# EAGLE design emonTx V4.0.1 (EAGLE 9.6.2)
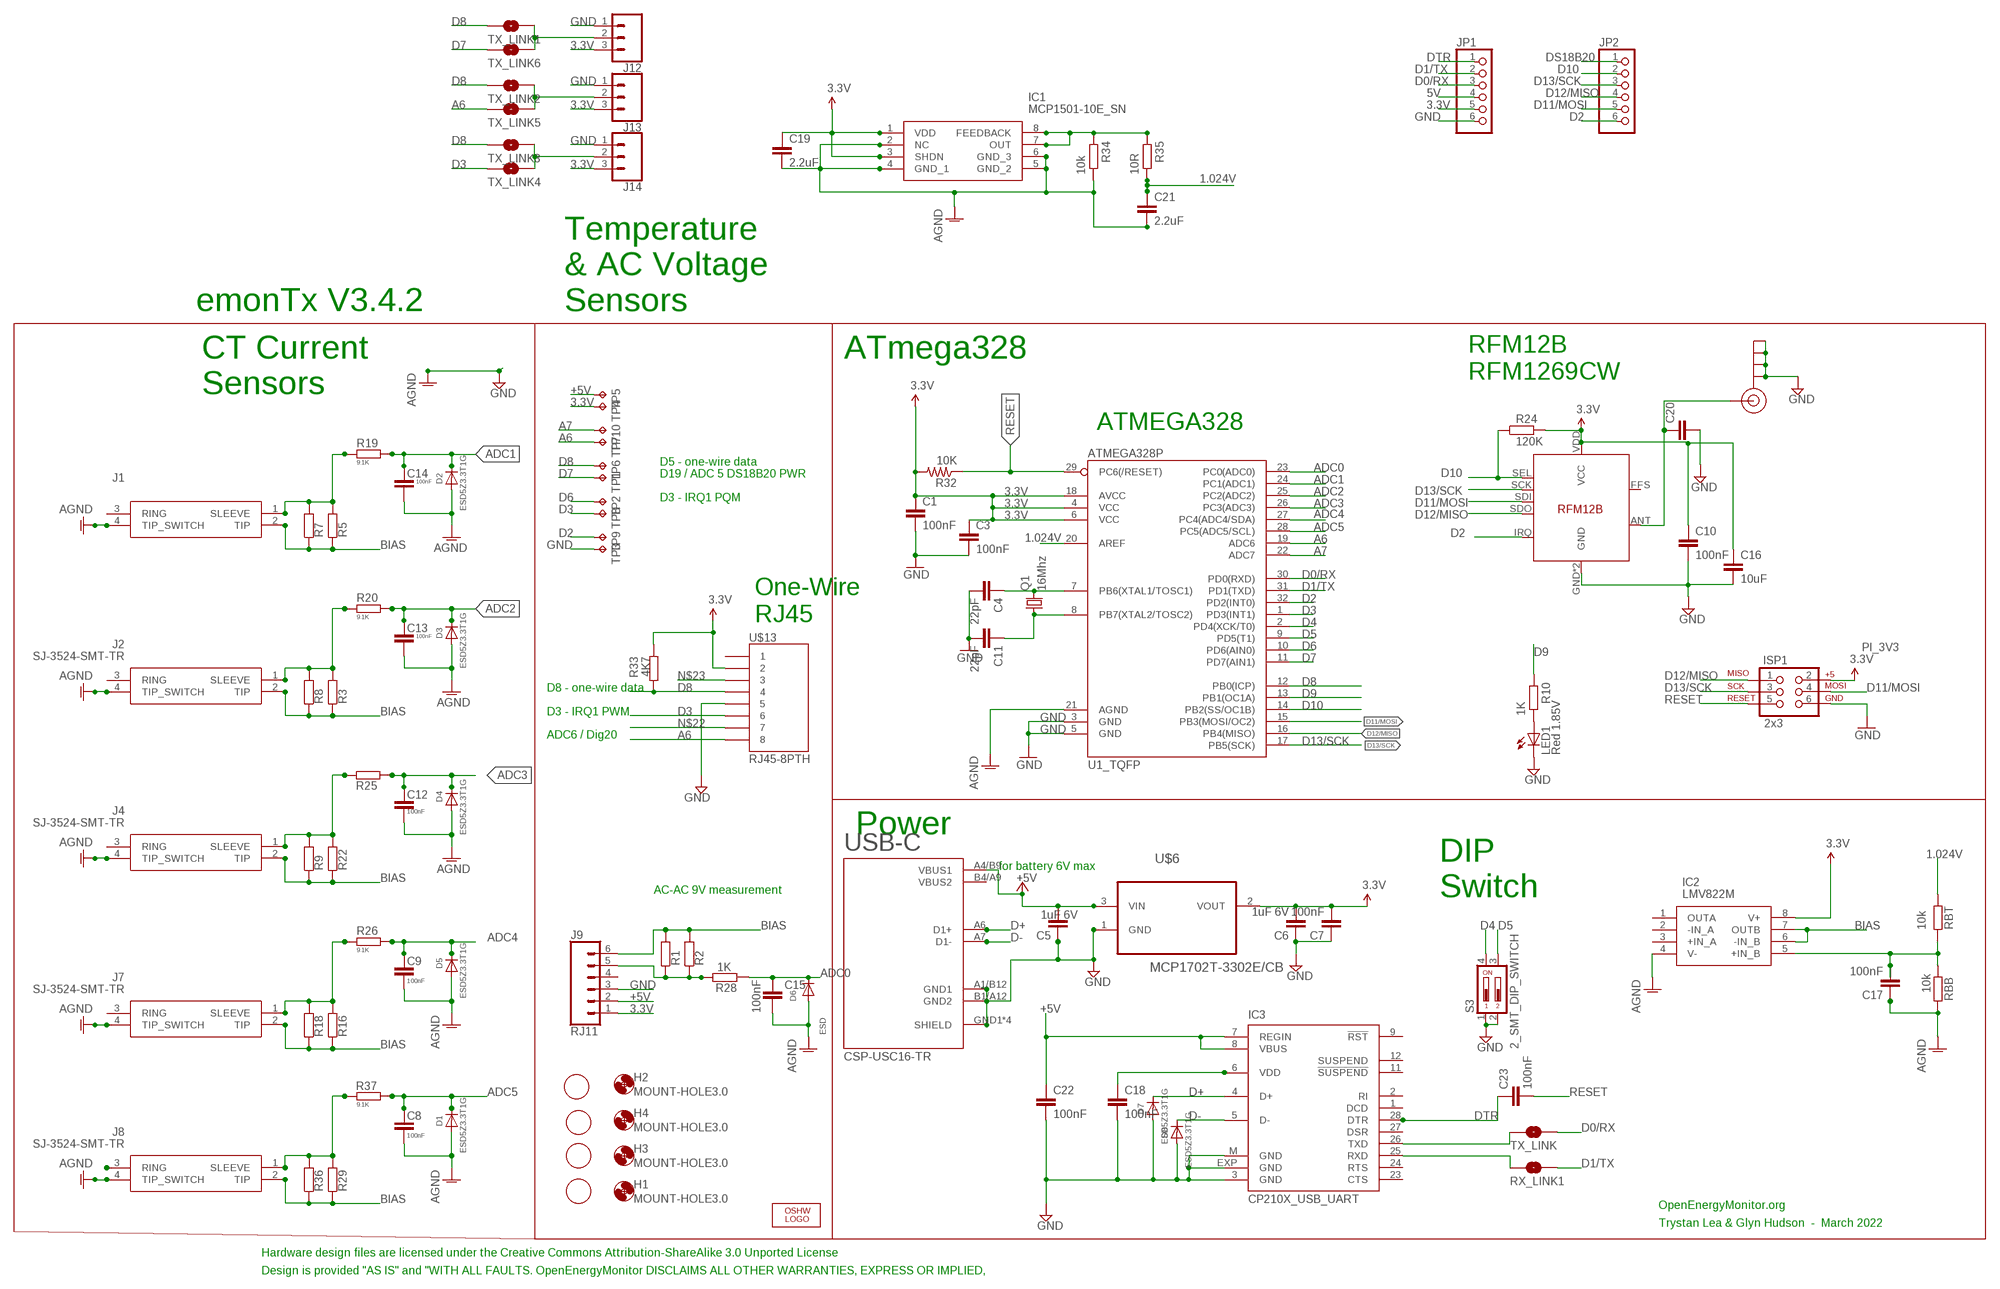
[diagram p0: schematic, sheet 1]

## Parts
C1  100nF  C-EUC0603  [C0603]
C3  100nF  C-EUC0603  [C0603]
C4  22pF  C-EUC0603  [C0603]
C5  1uF 6V  C-EUC0603  [C0603]
C6  1uF 6V  C-EUC0603  [C0603]
C7  100nF  C-EUC0603  [C0603]
C8  100nF  C-EUC0603  [C0603]
C9  100nF  C-EUC0603  [C0603]
C10  100nF  C-EUC0603  [C0603]
C11  22pF  C-EUC0603  [C0603]
C12  100nF  C-EUC0603  [C0603]
C13  100nF  C-EUC0603  [C0603]
C14  100nF  C-EUC0603  [C0603]
C15  100nF  C-EUC0603  [C0603]
C16  10uF  C-EUC0603  [C0603]
C17  100nF  C-EUC0603  [C0603]
C18  100nF  CAP0603-CAP  [0603-CAP]
C19  2.2uF  C-EUC0603  [C0603]
C20  ant tune?  C-EUC0603  [C0603]
C21  2.2uF  C-EUC0603  [C0603]
C22  100nF  CAP0603-CAP  [0603-CAP]
C23  100nF  C-EUC0603  [C0603]
D1  ESD5Z3.3T1G  DIODESOD-523  [SOD-523]
D2  ESD5Z3.3T1G  DIODESOD-523  [SOD-523]
D3  ESD5Z3.3T1G  DIODESOD-523  [SOD-523]
D4  ESD5Z3.3T1G  DIODESOD-523  [SOD-523]
D5  ESD5Z3.3T1G  DIODESOD-523  [SOD-523]
D6  ESD  DIODESOD-523  [SOD-523]
D7  ESD5Z3.3T1G  DIODESOD-523  [SOD-523]
D8  ESD5Z3.3T1G  DIODESOD-523  [SOD-523]
H1  MOUNT-HOLE3.0  [3,0]
H2  MOUNT-HOLE3.0  [3,0]
H3  MOUNT-HOLE3.0  [3,0]
H4  MOUNT-HOLE3.0  [3,0]
IC1  MCP1501-10E_SN  [SOIC127P600X175-8N]
IC2  LMV822M  [SOIC127P600X175-8N]
IC3  CP210X_USB_UART  [MLP28]
ISP1  2x3  AVR_SPI_PRG_6PTH  [2X3]
J1  SJ-3524-SMT-TR  [SJ-3524-SMT-TR]
J2  SJ-3524-SMT-TR  [SJ-3524-SMT-TR]
J4  SJ-3524-SMT-TR  [SJ-3524-SMT-TR]
J7  SJ-3524-SMT-TR  [SJ-3524-SMT-TR]
J8  SJ-3524-SMT-TR  [SJ-3524-SMT-TR]
J9  RJ11  RJ11-6  [RJ11-6]
J12  CONN_03SCREW  [SCREWTERMINAL-3.5MM-3]
J13  CONN_03SCREW  [SCREWTERMINAL-3.5MM-3]
J14  CONN_03SCREW  [SCREWTERMINAL-3.5MM-3]
J$1  SMA_EDGE  [SMA-EDGE]
JP1  PINHD-1X6  [1X06]
JP2  PINHD-1X6  [1X06]
LED1  Red 1.85V  LEDCHIP-LED0805  [CHIP-LED0805]
LOGO1  OSHW_LOGO_6MILX0200-NT  [OSHW_6X200_NOTEXT]
Q1  16Mhz  CRYSTALHC49UP  [HC49UP]
R1  R-EU_0204/7  [0204/7]
R2  R-EU_R1206  [R1206]
R3  R-EU_0204/7  [0204/7]
R5  R-EU_0204/7  [0204/7]
R7  R-EU_R1206  [R1206]
R8  R-EU_R1206  [R1206]
R9  R-EU_R1206  [R1206]
R10  1K  R-EU_R0603  [R0603]
R16  R-EU_0204/7  [0204/7]
R18  R-EU_R1206  [R1206]
R19  9.1K  R-EU_R0603  [R0603]
R20  9.1K  R-EU_R0603  [R0603]
R22  R-EU_0204/7  [0204/7]
R24  120K  R-EU_R0603  [R0603]
R25  9.1K  R-EU_R0603  [R0603]
R26  9.1K  R-EU_R0603  [R0603]
R28  1K  R-EU_R0603  [R0603]
R29  R-EU_0204/7  [0204/7]
R32  10K  R-US_R0603  [R0603]
R33  4K7  R-EU_R0603  [R0603]
R34  10k  R-EU_R0603  [R0603]
R35  10R  R-EU_R0603  [R0603]
R36  R-EU_R1206  [R1206]
R37  9.1K  R-EU_R0603  [R0603]
RBB  10k  R-EU_R0603  [R0603]
RBT  10k  R-EU_R0603  [R0603]
RX_LINK1  SOLDERJUMPERNC  [SJ_2S]
S3  2_SMT_DIP_SWITCH  [DIP_SWITCH_SMT]
TP1  TPPAD1-13  [P1-13]
TP2  TPPAD1-13  [P1-13]
TP3  TPPAD1-13  [P1-13]
TP4  TPPAD1-13  [P1-13]
TP5  TPPAD1-13  [P1-13]
TP6  TPPAD1-13  [P1-13]
TP7  TPPAD1-13  [P1-13]
TP8  TPPAD1-13  [P1-13]
TP9  TPPAD1-13  [P1-13]
TP10  TPPAD1-13  [P1-13]
TX_LINK  SOLDERJUMPERNC  [SJ_2S]
TX_LINK1  SOLDERJUMPERNC  [SJ_2S]
TX_LINK2  SOLDERJUMPERNC  [SJ_2S]
TX_LINK3  SOLDERJUMPERNC  [SJ_2S]
TX_LINK4  SOLDERJUMPERNC  [SJ_2S]
TX_LINK5  SOLDERJUMPERNC  [SJ_2S]
TX_LINK6  SOLDERJUMPERNC  [SJ_2S]
U1_TQFP  ATMEGA328P  ATMEGA328_SMT  [TQFP32-08]
U$1  FIDUCIAL  [FIDUCIAL_1MM]
U$4  FIDUCIAL  [FIDUCIAL_1MM]
U$5  FIDUCIAL  [FIDUCIAL_1MM]
U$6  MCP1702T-3302E/CB  MCP1700T-3302E/TT  [SOT95P237X112-3N]
U$7  FIDUCIAL  [FIDUCIAL_1MM]
U$13  RJ45-8PTH  [RJ45-8]
U$14  RFM12B  [RFM12B]
USB-C  CSP-USC16-TR  [USB-C]

## Nets
1.024V: C21.1 R35.1 RBT.2 U1_TQFP.20(AREF)
3.3V: C1.1 C3.1 C6.2 C7.2 C10.1 C16.1 C19.1 IC1.1(VDD) IC1.3(SHDN) IC2.8(V+) ISP1.2 J9.1 J12.3 J13.3 J14.3 JP1.5 R24.2 R32.2 R33.1 TP4.TP U1_TQFP.4(VCC) U1_TQFP.6(VCC) U1_TQFP.18(AVCC) U$6.2(VOUT) U$13.2 U$14.VDD(VCC)
5V: JP1.4
+5V [power]: C5.2 C22.1 IC3.7(REGIN) IC3.8(VBUS) J9.2 TP5.TP U$6.3(VIN) USB-C.A4/B9(VBUS1)
A6: TP7.TP TX_LINK5.1 U1_TQFP.19(ADC6) U$13.8
A7: TP10.TP U1_TQFP.22(ADC7)
ADC0: C15.1 D6.K(C) R28.1 U1_TQFP.23(PC0(ADC0))
ADC1: C14.1 D2.K(C) R19.2 U1_TQFP.24(PC1(ADC1))
ADC2: C13.1 D3.K(C) R20.2 U1_TQFP.25(PC2(ADC2))
ADC3: C12.1 D4.K(C) R25.1 U1_TQFP.26(PC3(ADC3))
ADC4: C9.1 D5.K(C) R26.2 U1_TQFP.27(PC4(ADC4/SDA))
ADC5: C8.1 D1.K(C) R37.2 U1_TQFP.28(PC5(ADC5/SCL))
AGND [gnd]: C8.2 C9.2 C12.2 C13.2 C14.2 C15.2 C17.1 C19.2 C21.2 D1.A D2.A D3.A D4.A D5.A D6.A IC1.2(NC) IC1.4(GND_1) IC1.5(GND_2) IC1.6(GND_3) IC2.4(V-) J1.4(TIP_SWITCH) J2.4(TIP_SWITCH) J4.4(TIP_SWITCH) J7.4(TIP_SWITCH) J8.4(TIP_SWITCH) R34.1 RBB.1 U1_TQFP.21(AGND)
BIAS: IC2.6(-IN_B) IC2.7(OUTB) J1.2(TIP) J2.2(TIP) J4.2(TIP) J7.2(TIP) J8.2(TIP) J9.6 R1.2 R2.2 R3.1 R5.1 R7.1 R8.1 R9.1 R16.1 R18.1 R22.1 R29.1 R36.1
D0/RX: JP1.3 TX_LINK.2 U1_TQFP.30(PD0(RXD))
D1/TX: JP1.2 RX_LINK1.2 U1_TQFP.31(PD1(TXD))
D2: JP2.6 TP9.TP U1_TQFP.32(PD2(INT0)) U$14.IRQ
D3: TP8.TP TX_LINK4.1 U1_TQFP.1(PD3(INT1)) U$13.6
D4: S3.4 U1_TQFP.2(PD4(XCK/T0))
D5: S3.3 U1_TQFP.9(PD5(T1))
D6: TP2.TP U1_TQFP.10(PD6(AIN0))
D7: TP1.TP TX_LINK6.1 U1_TQFP.11(PD7(AIN1))
D8: R33.2 TP6.TP TX_LINK1.1 TX_LINK2.1 TX_LINK3.1 U1_TQFP.12(PB0(ICP)) U$13.4
D9: R10.2 U1_TQFP.13(PB1(OC1A))
D10: JP2.2 R24.1 U1_TQFP.14(PB2(SS/OC1B)) U$14.SEL
D11/MOSI: ISP1.4 JP2.5 U1_TQFP.15(PB3(MOSI/OC2)) U$14.SDI
D12/MISO: ISP1.1 JP2.4 U1_TQFP.16(PB4(MISO)) U$14.SDO
D13/SCK: ISP1.3 JP2.3 U1_TQFP.17(PB5(SCK)) U$14.SCK
D+: D7.K(C) IC3.4(D+) USB-C.A6(D1+)
D-: D8.K(C) IC3.5(D-) USB-C.A7(D1-)
DIG1: C20.1 J$1.SIG(SIGNAL) U$14.ANT
DS18B20: JP2.1
DTR: C23.1 IC3.28(DTR) JP1.1
GND [gnd]: C1.2 C3.2 C4.2 C5.1 C6.1 C7.1 C10.2 C11.2 C16.2 C18.2 C20.2 C22.2 D7.A D8.A IC3.3(GND) IC3.EXP(GND) IC3.M(GND) ISP1.6 J9.3 J12.1 J13.1 J14.1 J$1.GND@0(GND) J$1.GND@1(GND) J$1.GND@2(GND) J$1.GND@3(GND) JP1.6 LED1.C S3.1 S3.2 TP3.TP U1_TQFP.3(GND) U1_TQFP.5(GND) U$6.1(GND) U$13.5 U$14.GND U$14.P$12(GND) USB-C.A1/B12(GND1) USB-C.B1/A12(GND2) USB-C.GND1(SHIELD) USB-C.GND2(SHIELD) USB-C.GND3(SHIELD) USB-C.GND4(SHIELD) ; supply symbol labelled AGND
N$1: C4.1 Q1.2 U1_TQFP.7(PB6(XTAL1/TOSC1))
N$2: J8.3(RING)
N$3: J4.1(SLEEVE) R9.2 R22.2 R25.2
N$4: C18.1 IC3.6(VDD)
N$5: IC3.26(TXD) TX_LINK.1
N$6: IC3.25(RXD) RX_LINK1.1
N$7: J9.5 R1.1 R2.1 R28.2
N$8: J7.1(SLEEVE) R16.2 R18.2 R26.1
N$9: C11.1 Q1.1 U1_TQFP.8(PB7(XTAL2/TOSC2))
N$10: J1.1(SLEEVE) R5.2 R7.2 R19.1
N$12: J8.1(SLEEVE) R29.2 R36.2 R37.1
N$13: J2.1(SLEEVE) R3.2 R8.2 R20.1
N$18: J12.2 TX_LINK1.2 TX_LINK6.2
N$19: J13.2 TX_LINK2.2 TX_LINK5.2
N$20: C17.2 IC2.5(+IN_B) RBB.2 RBT.1
N$21: J14.2 TX_LINK3.2 TX_LINK4.2
N$22: U$13.7
N$23: U$13.3
N$27: IC1.7(OUT) IC1.8(FEEDBACK) R34.2 R35.2
N$41: LED1.A R10.1
RESET: C23.2 ISP1.5 R32.1 U1_TQFP.29(PC6(/RESET))
Unconnected: IC2.1(OUTA) IC2.2(-IN_A) IC2.3(+IN_A) IC3.1(DCD) IC3.2(RI) IC3.9(!RST) IC3.11(!SUSPEND) IC3.12(SUSPEND) IC3.23(CTS) IC3.24(RTS) IC3.27(DSR) J1.3(RING) J2.3(RING) J4.3(RING) J7.3(RING) J9.4 U$13.1 U$14.FFS USB-C.B4/A9(VBUS2)

## Notes on the sheet
- emonTx V3.4.2
- Temperature 
  & AC Voltage
  Sensors
- ATmega328
- RFM12B
  RFM1269CW
- CT Current 
  Sensors
- ATMEGA328
- D5 - one-wire data
- D19 / ADC 5 DS18B20 PWR
- D3 - IRQ1 PQM
- One-Wire
  RJ45
- D8 - one-wire data
- D3 - IRQ1 PWM
- ADC6 / Dig20
- Power
- for battery 6V max
- AC-AC 9V measurement
- DIP
  Switch
- OpenEnergyMonitor.org
- Trystan Lea & Glyn Hudson  -  March 2022
- Hardware design files are licensed under the Creative Commons Attribution-ShareAlike 3.0 Unported License
- Design is provided "AS IS" and "WITH ALL FAULTS. OpenEnergyMonitor DISCLAIMS ALL OTHER WARRANTIES, EXPRESS OR IMPLIED,

## Library data of the parts
C1 C8-C10 C12-C16 C19-C21 C23 = rcl:C-EU: CAPACITOR, European symbol
C3-C7 C11 C17 = resistor:C-EU: CAPACITOR, European symbol
C18 C22 = SparkFun:CAP: Capacitor Standard 0603 ceramic capacitor, and 0.1" leaded capacitor.
D1-D8 = microbuilder:DIODE: Diode SMA Model Volts Amps Type Vf Vr Digikey # Notes SSA34-E3 40V 3A Schottky 480mV @ 3A 200uA @ 40V SSA34-E3/61TGITR-ND CDBA120-G 20V 1A Schottky 500mV @ 1A 500uA @ 20V 641-1014-6-ND REEL MBRA210 10V 2A Schottky 350mV @ 2A 700uA @ 10V MBRA210LT3 SOD-123 Model Volts Amps Type Vf Vr Order # Notes BAT54T1G 30V 200mA Schottky 800mV @ 200mA 2uA @ 25V BAT54T1GOSTR-ND B0530W 30V 500mA Schottky 430mV @ 500mA 130uA @ 30V B0530W-FDICT-ND REEL MBR120 1A 20V Schottky 340mV @ 1A MBR120VLSFT1GOSCT-ND SOD-323 Model Volts Amps Type Vf Vr Order # Notes PMEG2005EJ 20V 500mA Schottky 355mV @ 500mA 568-4110-1-ND ZLLS410 10V 570mA Schottky 380mV @ 570mA ZLLS410CT-ND 1N4148WS 75V 150mA Silicon/Simple 1V 1N4148WSFSCT-ND REEL SOD-523 Model Volts Amps Type Vf Vr Order # Notes BAT54XV2 30V 200mA Schottky 0.8V @ 100mA BAT54XV2CT-ND TB751S 30V 30mA Schottky RB751S-40TE61CT-ND SOT23-R/W (R = Solder Paste/Reflow Ovens, W = Hand-Soldering) Model Volts Amps Type Vf Vr Order # Notes BAT54FILM 40V 300mA Schottky 497-7162-1-ND
H1-H4 = holes:MOUNT-HOLE: MOUNTING HOLE with drill center marker
IC1 = MCP1501-10E_SN:MCP1501-10E_SN: MICROCHIP - MCP1501-10E/SN - VOLTAGE REF, SERIES, 1.024V, NSOIC-8 Source: Datasheet <http://www.farnell.com/datasheets/2015662.pdf>; ARROW_PART_NUMBER: MCP1501-10E/SN; ARROW_PRICE-STOCK: https://www.arrow.com/en/products/mcp1501-10esn/microchip-technology; DESCRIPTION: MICROCHIP - MCP1501-10E/SN - VOLTAGE REF, SERIES, 1.024V, NSOIC-8; HEIGHT: 1.75mm; MANUFACTURER_NAME: Microchip; MANUFACTURER_PART_NUMBER: MCP1501-10E/SN; MOUSER_PART_NUMBER: 579-MCP1501-10E/SN; MOUSER_PRICE-STOCK: https://www.mouser.co.uk/ProductDetail/Microchip-Technology/MCP1501-10E-SN?qs=BA62vJVifGrukY%252BvRXgfwQ%3D%3D
IC2 = LMV822M:LMV822M: Op Amps Source: Datasheet; ARROW_PART_NUMBER: LMV822M; ARROW_PRICE-STOCK: https://www.arrow.com/en/products/lmv822m/texas-instruments; DESCRIPTION: Op Amps; HEIGHT: mm; MANUFACTURER_NAME: Texas Instruments; MANUFACTURER_PART_NUMBER: LMV822M; MOUSER_PART_NUMBER: 926-LMV822M; MOUSER_PRICE-STOCK: https://www.mouser.co.uk/ProductDetail/Texas-Instruments/LMV822M?qs=7lkVKPoqpbaMZScIkY1cXg%3D%3D
IC3 = SparkFun-DigitalIC:CP210X_USB_UART: Single-Chip USB to UART Bridge Source: www.silabs.com .. CP2101.pdf / cp2102.pdf. Spark Fun Electronics SKU : COM-00310
ISP1 = SparkFun:AVR_SPI_PRG_6: AVR ISP 6 Pin This is the reduced ISP connector for AVR programming. Common on Arduino. This footprint will take up less PCB space and can be used with a 10-pin to 6-pin adapter such as SKU: BOB-08508
J1 J2 J4 J7 J8 = SJ-3524-SMT-TR:SJ-3524-SMT-TR: Phone Connectors Audio Jacks Source: Datasheet <https://datasheet.datasheetarchive.com/originals/distributors/Datasheets-DGA1/151896.pdf>; ARROW_PART_NUMBER: SJ-3524-SMT-TR; ARROW_PRICE-STOCK: https://www.arrow.com/en/products/sj-3524-smt-tr/cui-devices?region=nac; DESCRIPTION: Phone Connectors Audio Jacks; HEIGHT: mm; MANUFACTURER_NAME: CUI Inc.; MANUFACTURER_PART_NUMBER: SJ-3524-SMT-TR; MOUSER_PART_NUMBER: 490-SJ-3524-SMT-TR; MOUSER_PRICE-STOCK: https://www.mouser.co.uk/ProductDetail/CUI-Devices/SJ-3524-SMT-TR?qs=WyjlAZoYn50%252B7OcNbxvx%252BA%3D%3D
J9 = SparkFun-Connectors:RJ11-6: RJ11 Jack - 6 pin Commonly found on CAT3 devices and some Microchip programmers. Here is the connector we sell at SparkFun: RJ11 6-Pin Connector <https://www.sparkfun.com/products/132> (PRT-00132) Datasheet <http://www.sparkfun.com/datasheets/Prototyping/Connectors/RJ11-Datasheet.pdf> It is used on this SparkFun product: SparkFun Weather Shield <https://www.sparkfun.com/products/12081> (DEV-12081) Weather Meters <https://www.sparkfun.com/products/8942> (SEN-08942); PROD_ID: CONN-08590; SF_ID: PRT-00132
J12-J14 = SparkFun-Connectors:CONN_03: Multi connection point. Often used as Generic Header-pin footprint for 0.1 inch spaced/style header connections On any of the 0.1 inch spaced packages, you can populate with these: Break Away Headers - Straight <https://www.sparkfun.com/products/116> (PRT-00116) Break Away Male Headers - Right Angle <https://www.sparkfun.com/products/553> (PRT-00553) Female Headers <https://www.sparkfun.com/products/115> (PRT-00115) Break Away Headers - Machine Pin <https://www.sparkfun.com/products/117> (PRT-00117) Break Away Female Headers - Swiss Machine Pin <https://www.sparkfun.com/products/743> (PRT-00743) Stackable Header - 3 Pin (Female, 0.1") <https://www.sparkfun.com/products/13875> (PRT-13875) For SCREWTERMINALS and SPRING TERMINALS visit here: Screw Terimnals on SparkFun.com <https://www.sparkfun.com/search/results?term=Screw+Terminals> (5mm/3.5mm/2.54mm spacing) This device is also useful as a general connection point to wire up your design to another part of your project. Our various solder wires solder well into these plated through hole pads. Hook-Up Wire - Assortment (Stranded, 22 AWG) <https://www.sparkfun.com/products/11375> (PRT-11375) Hook-Up Wire - Assortment (Solid Core, 22 AWG) <https://www.sparkfun.com/products/11367> (PRT-11367) View the entire wire category on our website here <https://www.sparkfun.com/categories/141> Special notes: Molex polarized connector foot print use with SKU : PRT-08232 with associated crimp pins and housings.; PROD_ID: CONN-08288; SF_ID: PRT-08235
J$1 = SparkFun-Connectors:SMA_EDGE: SMA Antenna Connector End launch SMA connector. The paste layer has been removed so that the connector can be hand soldered onto the board after reflow.
JP1 JP2 = adafruit:PINHD-1X6: PIN HEADER
LED1 = adafruit:LED: LED OSRAM: - CHIPLED LG R971, LG N971, LY N971, LG Q971, LY Q971, LO R971, LY R971 LH N974, LH R974 LS Q976, LO Q976, LY Q976 LO Q996 - Hyper CHIPLED LW Q18S LB Q993, LB Q99A, LB R99A - SideLED LS A670, LO A670, LY A670, LG A670, LP A670 LB A673, LV A673, LT A673, LW A673 LH A674 LY A675 LS A676, LA A676, LO A676, LY A676, LW A676 LS A679, LY A679, LG A679 - Hyper Micro SIDELED® LS Y876, LA Y876, LO Y876, LY Y876 LT Y87S - SmartLED LW L88C, LW L88S LB L89C, LB L89S, LG L890 LS L89K, LO L89K, LY L89K LS L896, LA L896, LO L896, LY L896 - TOPLED LS T670, LO T670, LY T670, LG T670, LP T670 LSG T670, LSP T670, LSY T670, LOP T670, LYG T670 LG T671, LOG T671, LSG T671 LB T673, LV T673, LT T673, LW T673 LH T674 LS T676, LA T676, LO T676, LY T676, LB T676, LH T676, LSB T676, LW T676 LB T67C, LV T67C, LT T67C, LS T67K, LO T67K, LY T67K, LW E67C LS E67B, LA E67B, LO E67B, LY E67B, LB E67C, LV E67C, LT E67C LW T67C LS T679, LY T679, LG T679 LS T770, LO T770, LY T770, LG T770, LP T770 LB T773, LV T773, LT T773, LW T773 LH T774 LS E675, LA E675, LY E675, LS T675 LS T776, LA T776, LO T776, LY T776, LB T776 LHGB T686 LT T68C, LB T68C - Hyper Mini TOPLED® LB M676 - Mini TOPLED Santana® LG M470 LS M47K, LO M47K, LY M47K Source: http://www.osram.convergy.de/
LOGO1 = ohw-logo:OSHW_LOGO_6MIL
Q1 = adafruit:CRYSTAL: CRYSTAL; OC_FARNELL: unknown; OC_NEWARK: unknown
R1-R3 R5 R7-R10 R16 R18-R20 R22 R24-R26 R28 R29 R33-R37 = rcl:R-EU_: RESISTOR, European symbol
R32 = adafruit:R-US_: RESISTOR, American symbol
RBB RBT = resistor:R-EU_: RESISTOR, European symbol
RX_LINK1 TX_LINK TX_LINK1-TX_LINK6 = SparkFun:SOLDERJUMPER: Solder Jumper Standard SMD solder jumper. Used to automate production. Two varients : Normally Open and Normally Closed are the same, but have different paste layers. NC will have a large amount of paste and should jumper during reflow.
S3 = OpenEnergyMonitor:2_SMT_DIP_SWITCH: Multicomp MCEMR-02-T 2 throw SMT DIP switch, Farnell 1524005
TP1-TP10 = testpad:TP: Test pad
U1_TQFP = SparkFun-DigitalIC:ATMEGA328_SMT: 32-Pin Atmega328 part Commonly used on Arduino compatible boards Available in QFP and QFN packages TQFP is IC-09069 QFN is non-stock; PROD_ID: IC-09069
U$1 U$4 U$5 U$7 = adafruit:FIDUCIAL: For use by pick and place machines to calibrate the vision/machine, 1mm By microbuilder.eu
U$6 = Farnell_MCP1700:MCP1700T-3302E/TT: Low Quiescent Current LDO; MPN: MCP1700T-3302E/TT; OC_FARNELL: 1296592; OC_NEWARK: 88H9817; PACKAGE: SOT23-3; SUPPLIER: Microchip
U$13 = SparkFun-Connectors:RJ45-8: RJ45 Jack Simple RJ45, 8-pin connection - connector for common Cat5, Cat5e, and Cat6 Ethernet cables. Footprint not yet proven in production. Connector sku is PRT-00643; Breakout PCB sku is BOB-00716.
U$14 = JeeParts:RFM12B
USB-C = CSP-USC16-TR:CSP-USC16-TR: CSP-USC16-TR TOBY.CO.UK; MPN: CSP-USC16-TR

## Net classes
0 default: width 0.203 mm, drill 0.6 mm, clearance 0.203 mm
1 power: width 0.305 mm, drill 0.6 mm, clearance 0.254 mm
2 gnd: width 0.254 mm, drill 0.6 mm, clearance 0.254 mm

## Board
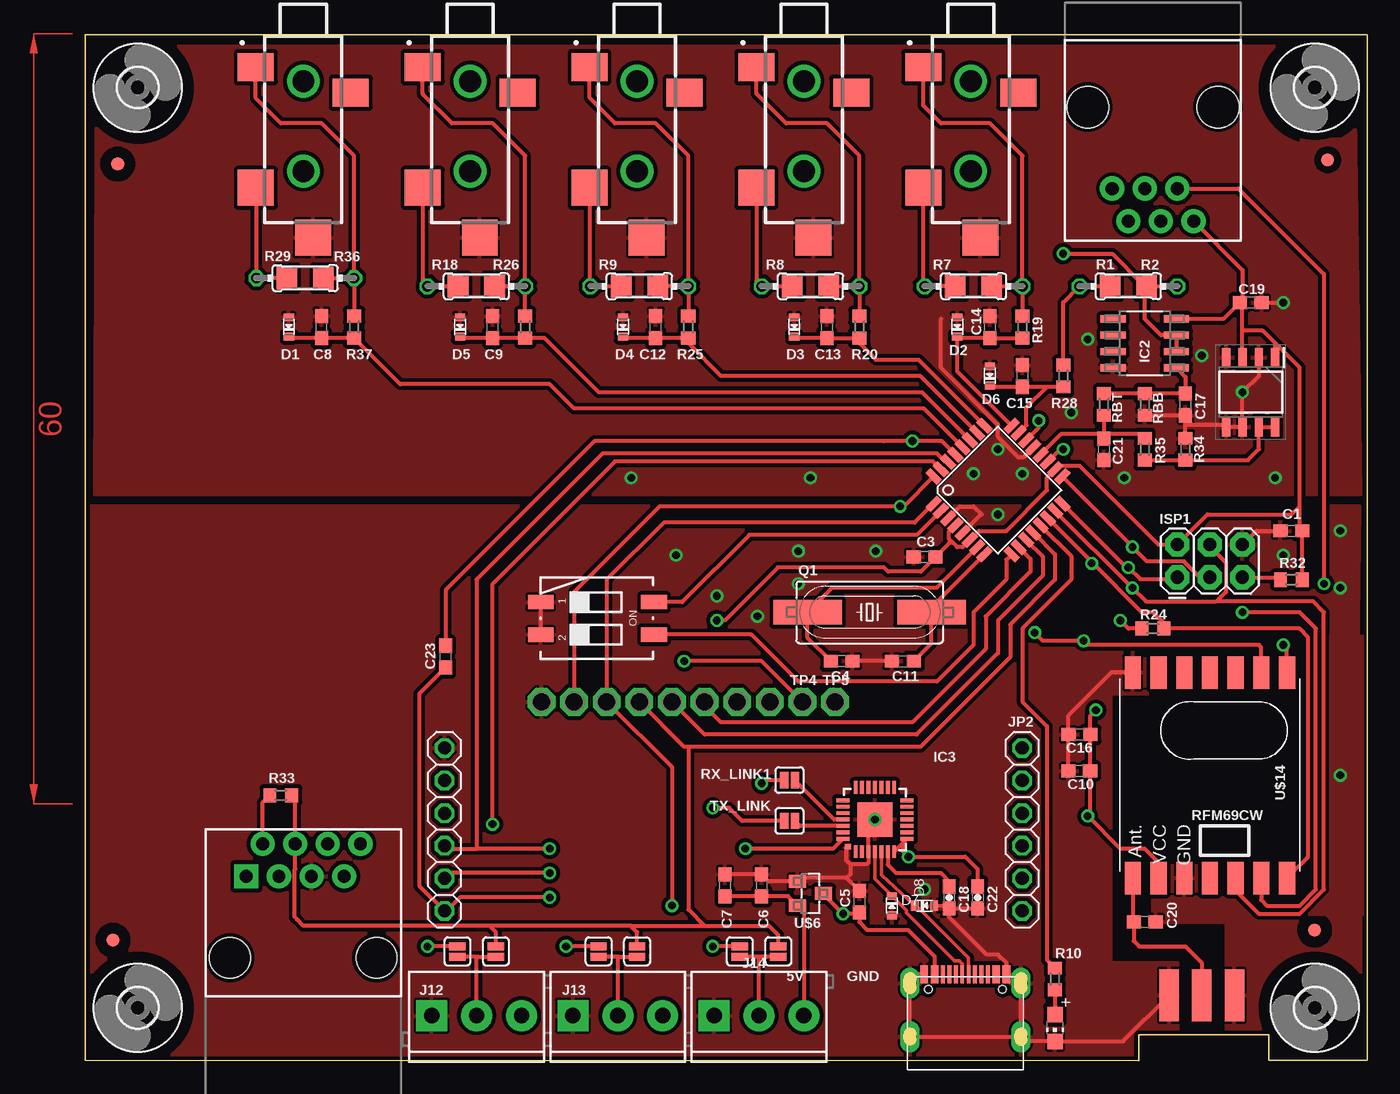
[diagram p1: board, top side]
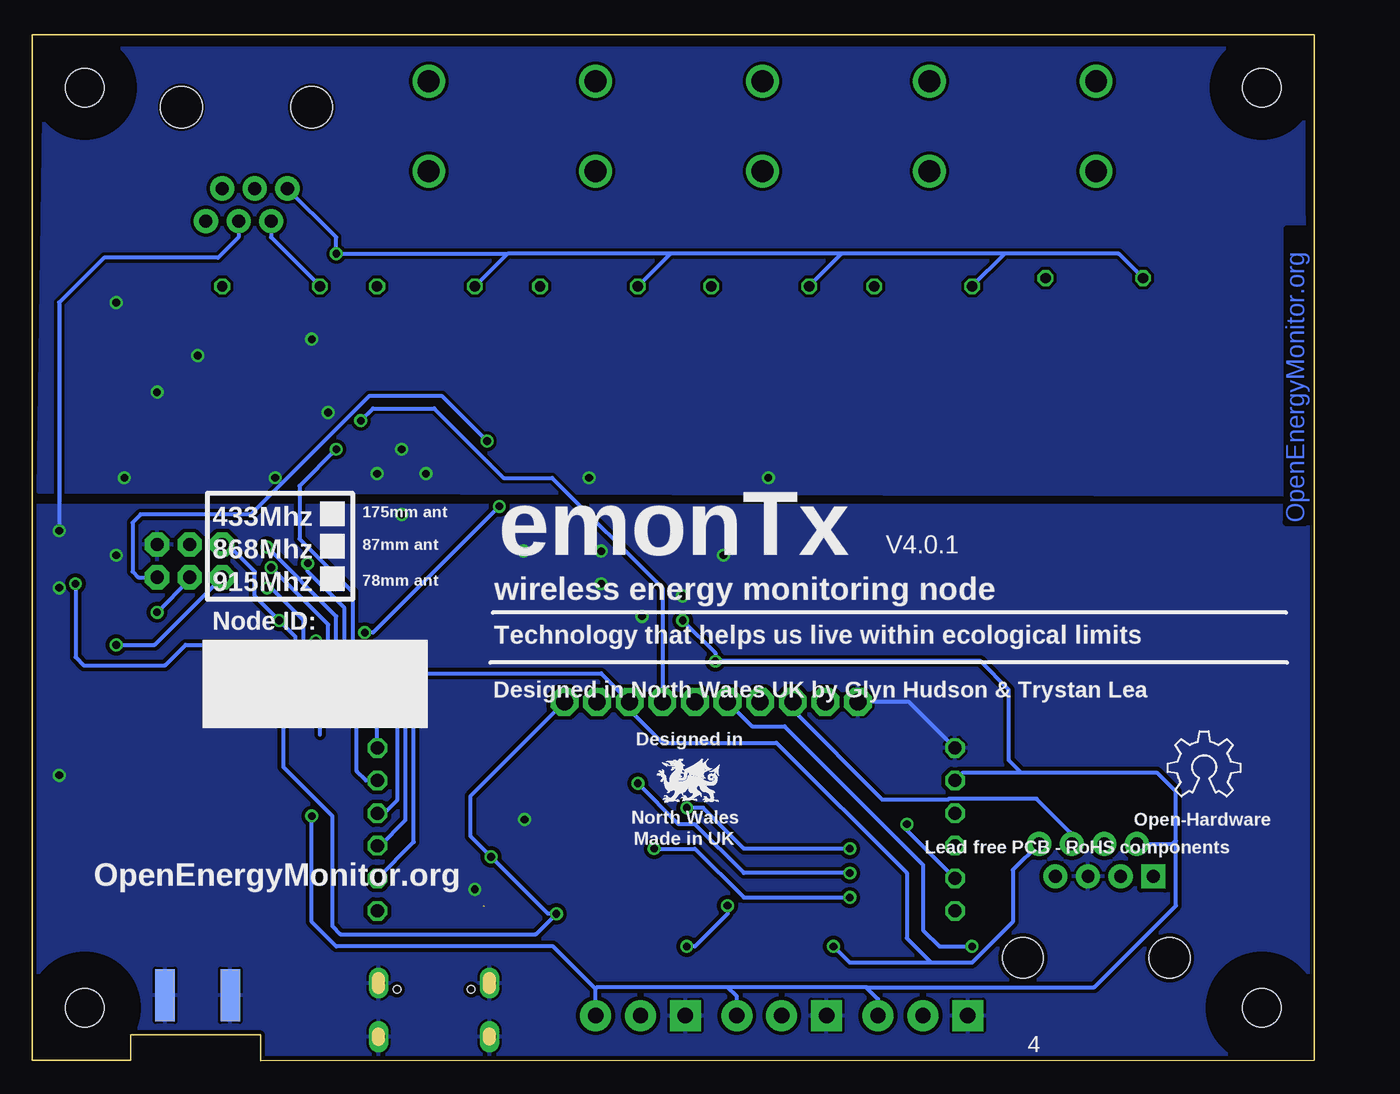
[diagram p2: board, bottom side, seen from below]

Size 99.9 x 79.91 mm. Coordinates in mm from the lower left corner, seen from the top.
Outline: 0,79.91 0,0.01 82.1,0 82.1,2 92.2,2 92.2,0.01 99.9,0.01 99.9,79.91 0,79.91
Copper layers (1*16): Top 0.035mm / dielectric 1.5mm / Bottom 0.035mm
Design rules "default *": minimum track width 8mil, minimum drill 0.5mm, track to track 8mil, track to pad 8mil, pad to pad 8mil, via to via 10mil, smd to smd 7mil, copper to edge 8mil, drill to drill 8mil, minimum pad ring 8mil, minimum via ring 8mil, stop-mask expansion 0.075mm, vias tented up to drill 0.6mm, thermal gap 8mil

### Footprints (pad centres in the part's own frame; a part is rotated, then mirrored left to right if it is on the bottom)
C0603 = smd 1.1 x 1: 1 -0.85,0; 2 0.85,0
0603-CAP = smd 1.1 x 1: 1 -0.85,0; 2 0.85,0
SOD-523 = smd 0.8 x 0.6: A 0,-0.75; K 0,0.75
3,0 = hole 3: 0,0
SOIC127P600X175-8N = smd 1.5 x 0.65: 1 -2.7,1.905; 2 -2.7,0.635; 3 -2.7,-0.635; 4 -2.7,-1.905; 5 2.7,-1.905; 6 2.7,-0.635; 7 2.7,0.635; 8 2.7,1.905
SOIC127P600X175-8N' = smd 1.981 x 0.559: 1 -2.464,1.905; 2 -2.464,0.635; 3 -2.464,-0.635; 4 -2.464,-1.905; 5 2.464,-1.905; 6 2.464,-0.635; 7 2.464,0.635; 8 2.464,1.905
MLP28 = smd 1 x 0.3: 1 -2.5,1.5; 2 -2.5,1; 3 -2.5,0.5; 4 -2.5,0; 5 -2.5,-0.5; 6 -2.5,-1; 7 -2.5,-1.5; 15 2.5,-1.5; 16 2.5,-1; 17 2.5,-0.5; 18 2.5,0; 19 2.5,0.5; 20 2.5,1; 21 2.5,1.5 | smd 0.3 x 1: 8 -1.5,-2.5; 9 -1,-2.5; 10 -0.5,-2.5; 11 0,-2.5; 12 0.5,-2.5; 13 1,-2.5; 14 1.5,-2.5; 22 1.5,2.5; 23 1,2.5; 24 0.5,2.5; 25 0,2.5; 26 -0.5,2.5; 27 -1,2.5; 28 -1.5,2.5 | smd 2.7 x 2.7: EXP 0,0 | smd 0.435 x 0.435: M -2.103,2.103
2X3 = drill 1.016 pad 1.88 octagon: 1 0,0; 2 0,2.54; 3 2.54,0; 4 2.54,2.54; 5 5.08,0; 6 5.08,2.54
SJ-3524-SMT-TR = smd 2.2 x 2.8: 1 2.4,-6.7; 3 4.4,0.7 | smd 2.8 x 2.8: 2 11.8,-6.7; 4 15.7,-2.25 | drill 1.7 pad 2.55: 5 3.5,-3; 6 10.5,-3
RJ11-6 = drill 1.016 pad 1.88: 1 -3.175,8.89; 2 -1.905,6.35; 3 -0.635,8.89; 4 0.635,6.35; 5 1.905,8.89; 6 3.175,6.35 | hole 3.251: -5.08,0; 5.08,0
SCREWTERMINAL-3.5MM-3 = drill 1.2 pad 2.413 square: 1 0,0 | drill 1.2 pad 2.413: 2 3.5,0; 3 7,0
SMA-EDGE = smd 1.524 x 4.064: GND@0 0,0; GND@1 5.08,0; SIG 2.54,0 | smd 1.524 x 4.064 bottom: GND@2 0,0; GND@3 5.08,0
1X06 = drill 1.016 octagon: 1 -6.35,0; 2 -3.81,0; 3 -1.27,0; 4 1.27,0; 5 3.81,0; 6 6.35,0
CHIP-LED0805 = smd 1.2 x 1.2: A 0,-1.05; C 0,1.05
HC49UP = smd 5.334 x 1.93: 1 -4.826,0; 2 4.826,0
0204/7 = drill 0.813 octagon: 1 -3.81,0; 2 3.81,0
R1206 = smd 1.6 x 1.803: 1 -1.422,0; 2 1.422,0
R0603 = smd 1 x 1.1: 1 -0.85,0; 2 0.85,0
SJ_2S = smd 0.635 x 1.27: 1 -0.412,0; 2 0.412,0
DIP_SWITCH_SMT = smd 1.1 x 2: 1 -1.27,-4.215; 2 1.27,-4.215; 3 1.27,4.615; 4 -1.27,4.615
P1-13 = drill 1.321 pad 2.159 octagon: TP 0,0
TQFP32-08 = smd 1.27 x 0.559: 1 -4.293,2.8; 2 -4.293,2; 3 -4.293,1.2; 4 -4.293,0.4; 5 -4.293,-0.4; 6 -4.293,-1.2; 7 -4.293,-2; 8 -4.293,-2.8; 17 4.293,-2.8; 18 4.293,-2; 19 4.293,-1.2; 20 4.293,-0.4; 21 4.293,0.4; 22 4.293,1.2; 23 4.293,2; 24 4.293,2.8 | smd 0.559 x 1.27: 9 -2.8,-4.293; 10 -2,-4.293; 11 -1.2,-4.293; 12 -0.4,-4.293; 13 0.4,-4.293; 14 1.2,-4.293; 15 2,-4.293; 16 2.8,-4.293; 25 2.8,4.293; 26 2,4.293; 27 1.2,4.293; 28 0.4,4.293; 29 -0.4,4.293; 30 -1.2,4.293; 31 -2,4.293; 32 -2.8,4.293
FIDUCIAL_1MM = smd 1 x 1: 1 0,0
SOT95P237X112-3N = smd 0.991 x 1.321: 1 -0.94,-1.016; 2 0.94,-1.016; 3 0,1.016
RJ45-8 = drill 1 pad 1.88 square: 1 -4.445,6.35 | drill 1 pad 1.88: 2 -3.175,8.89; 3 -1.905,6.35; 4 -0.635,8.89; 5 0.635,6.35; 6 1.905,8.89; 7 3.175,6.35; 8 4.445,8.89 | hole 3.2: -5.715,0; 5.715,0
RFM12B = smd 2.54 x 1.27: ANT 8,-6; FFS -8,2; GND 8,-2; IRQ -8,4; P$8 -8,0; P$9 -8,-2; P$10 -8,-4; P$12 -8,-6; P$16 8,0; SCK 8,4; SDI 8,2; SDO -8,6; SEL 8,6; VDD 8,-4
USB-C = smd 0.6 x 1.4: A1/B12 -3.2,0.7; A4/B9 -2.4,0.7; B1/A12 3.2,0.7; B4/A9 2.4,0.7 | smd 0.3 x 1.4: A5 -1.25,0.7; A6 -0.25,0.7; A7 0.25,0.7; A8 1.25,0.7; B5 1.75,0.7; B6 0.75,0.7; B7 -0.75,0.7; B8 -1.75,0.7 | drill 1 pad 1.2 long: GND1 -4.32,0; GND2 4.33,0; GND3 4.33,-4.18; GND4 -4.32,-4.18 | hole 0.6: -2.89,-0.5; 2.89,-0.5

### Placement (x,y rotation side)
C1  93.98,41.27 180 top
C3  65.41,39.24 180 top
C4  58.95,31.11 0 top
C5  60.33,12.38 270 top
C6  52.7,13.65 270 top
C7  49.85,13.65 270 top
C8  18.41,57.15 90 top
C9  31.75,57.15 90 top
C10  77.45,22.56 180 top
C11  63.71,31.11 180 top
C12  44.45,57.15 90 top
C13  57.78,57.15 90 top
C14  70.48,57.15 90 top
C15  73.03,53.34 90 top
C16  77.47,25.4 180 top
C17  85.72,51.12 90 top
C18  67.31,12.7 270 top
C19  90.81,59.05 0 top
C20  82.55,10.79 0 top
C21  79.38,47.62 270 top
C22  69.53,12.7 270 top
C23  28.09,31.48 90 top
D1  15.88,57.15 180 top
D2  67.94,57.15 180 top
D3  55.24,57.15 180 top
D4  41.91,57.15 180 top
D5  29.21,57.15 180 top
D6  70.48,53.34 180 top
D7  62.87,12.06 0 top
D8  65.41,12.06 90 top
H1  4.1,75.81 0 top
H2  95.8,75.81 0 top
H3  4.1,4.11 0 top
H4  95.8,4.11 0 top
IC1  90.81,52.07 270 top
IC2  LMV822M  [SOIC127P600X175-8N']  82.55,55.88 0 top
IC3  61.53,18.78 90 top
ISP1  85.09,37.66 0 top
J1  72,79.8 270 top
J2  59,79.8 270 top
J4  46,79.8 270 top
J7  33,79.8 270 top
J8  20,79.8 270 top
J9  83.19,74.3 180 top
J12  27,3.5 0 top
J13  38,3.5 0 top
J14  49,3.5 0 top
J$1  89.53,5.08 180 top
JP1  28,18 90 top
JP2  73,18 90 top
LED1  75.56,2.54 180 top
LOGO1  11.43,20.57 0 bottom
Q1  61.12,34.92 180 top
R1  81.28,60.33 0 top
R2  81.28,60.33 0 top
R3  56.52,60.33 0 top
R5  69.22,60.33 0 top
R7  69.22,60.33 0 top
R8  56.52,60.33 0 top
R9  43.18,60.33 0 top
R10  75.56,6.35 90 top
R16  30.48,60.33 0 top
R18  30.48,60.33 0 top
R19  73.03,57.15 270 top
R20  60.33,57.15 270 top
R22  43.18,60.33 0 top
R24  83.19,33.66 180 top
R25  46.99,57.15 90 top
R26  34.29,57.15 270 top
R28  76.2,53.34 90 top
R29  17.14,60.96 0 top
R32  93.98,37.47 0 top
R33  15.25,20.67 0 top
R34  85.72,47.62 270 top
R35  82.55,47.62 270 top
R36  17.14,60.96 0 top
R37  20.95,57.15 270 top
RBB  82.55,51.12 90 top
RBT  79.38,51.12 270 top
RX_LINK1  54.88,21.84 180 top
S3  39.71,34.45 270 top
TP1  45.72,27.94 0 top
TP2  48.26,27.94 0 top
TP3  35.56,27.94 0 top
TP4  55.88,27.94 0 top
TP5  58.42,27.94 0 top
TP6  43.18,27.94 0 top
TP7  53.34,27.94 0 top
TP8  40.64,27.94 0 top
TP9  38.1,27.94 0 top
TP10  50.8,27.94 0 top
TX_LINK  54.88,18.67 180 top
TX_LINK1  32,8.5 270 top
TX_LINK2  43,8.5 270 top
TX_LINK3  54,8.5 270 top
TX_LINK4  51,8.5 270 top
TX_LINK5  40,8.5 270 top
TX_LINK6  29,8.5 270 top
U1_TQFP  71.12,44.45 45 top
U$1  95.79,10.16 0 top
U$4  2.17,9.38 0 top
U$5  96.81,70.18 0 top
U$6  56.52,13.02 270 top
U$7  2.54,69.85 0 top
U$13  17,8 0 top
U$14  87.63,22.23 270 top
USB-C  68.58,6.03 0 top

### Tracks (layer width: path | path; a pad name or v marks a point on that pad's centre or on a via)
1.024V
  Top 0.305: U1_TQFP.20 76.03,48.79 79.06,48.79 C21.1 | R35.1 82.23,48.79 79.69,48.79 C21.1 | RBT.2 C21.1
3.3V  (via drill 0.6)
  Top 0.305: C7.2 C6.2 54.77,12.8 U$6.2 56,11.58 J14.3 | U$14.VDD 83.63,15.43 82.55,16.51 80.64,16.51 v78.11,19.05 78.3,19.25 C10.1 78.32,22.58 C16.1 78.32,26.89 v78.74,27.3 | 82.62,33.37 R24.2 81.28,33.66 v80.64,34.29 | IC1.1 92.71,55.88 | 90.17,56.85 90.17,58.84 | 90.17,58.84 C19.1 88.69,57.78 IC2.8 | 92.71,55.88 91.73,56.85 90.17,56.85 | R32.2 C1.1 94.61,41.49 94.61,43.18 | 94.61,43.18 93.98,42.55 87.44,42.55 ISP1.2 83.63,40.2 77.47,46.35 75.85,46.35 U1_TQFP.18 74.93,45.43 74.93,44.45 71.75,41.27 69.64,41.27 U1_TQFP.6 68.37,40.01 67.94,40.01 67.63,40.32 | 92.71,55.88 94.61,53.98 94.61,43.18 | 67.63,40.32 67.31,40.64 67.31,41.21 U1_TQFP.4 | 67.63,40.32 67.33,40.32 C3.1 65.11,38.1 62.55,38.1 62.23,38.42 53.98,38.42 49.85,34.29 v49.21,34.29 | IC1.3 90.17,56.85 | U$13.2 13.82,20.1 R33.1 | J9.1 90.17,61.59 90.17,58.84 | TP4.TP 52.7,31.11 v46.67,31.11
  Bottom 0.305: ISP1.2 84.64,40.2 82.55,38.1 82.55,36.2 v80.64,34.29 79.38,33.02 79.38,27.94 v78.74,27.3 77.47,26.04 77.47,25.4 | JP1.5 27.36,22.45 22.86,22.45 | 22.86,22.45 12.29,22.45 10.79,20.95 10.79,17.14 | J12.3 34,4.79 34.92,5.71 | 34.92,5.71 45.72,5.71 | 45.72,5.71 55.88,5.71 56,5.59 | J14.3 56,5.59 | 34.92,5.71 17.14,5.71 10.79,12.06 10.79,17.14 | U$13.2 11.05,16.89 10.79,17.14 | J13.3 45,5 45.72,5.71 | 56,5.59 59.3,8.89 76.2,8.89 78.11,10.79 v78.11,19.05 | 22.86,22.45 23.81,23.4 23.81,28.89 26.04,31.11 v46.67,31.11 46.67,31.75 v49.21,34.29
+5V  (via drill 0.6)
  Top 0.305: C5.2 60.33,11.11 | USB-C.A4/B9 66.18,8.12 64.14,10.16 60.96,10.16 60.33,10.79 C5.2 | IC3.7 63.7,16.95 | 63.7,16.95 IC3.8 | C5.2 60.22,11.43 v59.05,11.43 57.53,12.95 U$6.3 | 63.7,16.95 63.7,16.31 v64.14,15.88 68.58,15.88 69.53,14.92 C22.1 | J9.2 89.85,67.94 96.52,61.28 v96.52,37.15
  Bottom 0.305: v96.52,37.15 96.52,31.43 95.89,30.8 89.53,30.8 87.95,32.38 81.28,32.38 80.33,31.43 80.33,22.86 76.52,19.05 76.52,10.48 75.88,9.84 60.64,9.84 v59.05,11.43 59.69,11.43 v64.14,15.88 65.72,17.46 65.72,20.64 TP5.TP
A6  (via drill 0.6)
  Top 0.305: U1_TQFP.19 75.99,47.62 v76.2,47.62 | TX_LINK5.1 39.98,8.89 v37.47,8.89
  Bottom 0.305: v76.2,47.62 79.06,44.77 79.06,40.64 74.93,36.51 74.93,32.38 72.71,30.16 55.56,30.16 TP7.TP 53.34,27.3 50.8,24.77 41.91,24.77 31.75,14.61 31.75,9.53 29.84,7.62 | U$13.8 23.5,14.84 23.5,10.79 26.67,7.62 29.84,7.62 | 29.84,7.62 36.2,7.62 v37.47,8.89
A7  (via drill 0.6)
  Top 0.305: U1_TQFP.22 74.3,49.32 v74.3,49.85
  Bottom 0.305: v74.3,49.85 73.34,50.8 68.58,50.8 63.18,45.4 59.37,45.4 50.8,36.83 TP10.TP
ADC0
  Top 0.305: R28.1 74.93,52.49 | 74.93,52.49 C15.1 70.58,52.49 D6.K | U1_TQFP.23 73.34,49.5 73.34,50.9 74.93,52.49
ADC1
  Top 0.305: C14.1 R19.2 | C14.1 68.05,56.3 D2.K 67.94,53.7 U1_TQFP.24 | 70.7,56.3 C14.1
ADC2
  Top 0.305: 55.13,56.52 D3.K 55.34,56.3 C13.1 R20.2 60.33,55.88 61.59,54.61 64.92,54.61 U1_TQFP.25
ADC3
  Top 0.305: 69.33,48.9 U1_TQFP.26 65.06,53.34 49.53,53.34 46.99,55.88 R25.1 C12.1 | D4.K 41.91,56.52 42.12,56.3 C12.1 | D4.K 41.8,56.52 | C12.1 42.01,56.3 D4.K
ADC4
  Top 0.305: D5.K 29.31,56.3 C9.1 R26.2 35.77,56.3 40.01,52.07 65.2,52.07 U1_TQFP.27
ADC5
  Top 0.305: D1.K 15.97,56.3 C8.1 R37.2 24.55,52.7 36.2,52.7 38.1,50.8 65.34,50.8 U1_TQFP.28
AGND  (via drill 0.6)
  Top 0.305: RBB.1 C17.1 85.72,49.53 | R34.1 85.72,49.53 | 85.72,49.53 88.74,49.53 IC1.5 IC1.6 v90.17,52.07 91.44,53.34 IC1.2 | C19.2 v93.34,59.05 93.66,59.05 | U1_TQFP.21 73.09,46.99 72.71,46.99 71.12,48.58 71.12,49.53 66.67,53.98 66.67,57.78
  other vias: 78.11,56.2 87,54.93 76.83,50.48 80.96,45.4 92.71,45.4 71.12,47.62 69.22,45.72 73.03,45.72 42.55,45.4 56.52,45.4
  pour Top (isolate 0.305): 0.89,78.99 0.76,44.13 99.38,44.13 98.89,78.99
  pour Bottom (isolate 0): 0.76,44.07 99.38,44.31 98.89,78.87 0.89,78.87
BIAS  (via drill 0.6)
  Top 0.305: R3.1 | J7.2 26.3,60.7 R16.1 R18.1 | J4.2 39.3,60.4 R22.1 R9.1 | J2.2 52.3,60.73 R3.1 | R7.1 R5.1 65.3,60.43 J1.2 | IC2.6 IC2.7 83.82,56.52 82.55,57.78 82.55,59.69 83.19,60.33 | 82.55,59.91 82.34,60.12 82.34,60.33 | v76.2,62.87 80.01,62.87 82.34,60.53 82.34,60.33 | 82.34,60.33 R2.2 83.19,60.33 | 83.19,60.33 R1.2 | R3.1 R8.1 | R36.1 R29.1 13.34,67.97 J8.2
  Bottom 0.305: R29.1 15.24,62.87 24.13,62.87 | 24.13,62.87 36.83,62.87 | 36.83,62.87 50.17,62.87 | 50.17,62.87 62.87,62.87 | R3.1 50.17,62.87 | R22.1 36.83,62.87 | R16.1 24.13,62.87 | 62.87,62.87 R5.1 | J9.6 76.2,64.14 v76.2,62.87 | v76.2,62.87 | v76.2,62.87 62.87,62.87
D0/RX  (via drill 0.6)
  Top 0.305: U1_TQFP.30 67.03,46.64 66.36,47.31 40.32,47.31 30.48,37.47 30.48,16.51 | v36.2,16.51 30.48,16.51 | 30.48,16.51 28.22,16.51 JP1.3 | v48.9,19.68 50.16,19.68 51.18,18.67 TX_LINK.2
  Bottom 0.305: v36.2,16.51 44.45,16.51 47.62,19.68 v48.9,19.68
D1/TX  (via drill 0.6)
  Top 0.305: 66.39,46.35 U1_TQFP.31 66.64,46.07 66.04,46.67 41.27,46.67 31.75,37.15 v31.75,18.41 | JP1.2 28.41,14.61 v36.2,14.61 | RX_LINK1.2 52.96,21.84 v52.7,21.59
  Bottom 0.305: v36.2,14.61 44.45,14.61 48.26,18.41 49.53,18.41 v52.7,21.59 | JP1.2 31.99,18.18 v31.75,18.41
D2  (via drill 0.6)
  Top 0.305: U$14.IRQ 91.63,32.2 91.44,32.38 78.11,32.38 v77.79,32.7 74.61,32.7 v73.98,33.34 | U1_TQFP.32 63.78,43.18 v63.5,43.18 44.77,43.18 38.1,36.51 TP9.TP
  Bottom 0.305: JP2.6 73.03,24.38 73.03,26.67 77.79,31.43 v77.79,32.7 | v63.5,43.18 73.34,33.34 v73.98,33.34
D3  (via drill 0.6)
  Top 0.305: U1_TQFP.1 64.62,41.91 45.09,41.91 40.64,37.47 TP8.TP 45.72,22.86 v45.72,12.06 | TX_LINK4.1 50.98,8.89 v48.9,8.89
  Bottom 0.305: U$13.6 19.05,17.04 19.05,17.78 21.66,20.39 28.46,20.39 28.53,20.32 33.66,20.32 40.64,27.3 TP8.TP | v45.72,12.06 45.72,11.43 48.26,8.89 v48.9,8.89
D4
  Top 0.305: U1_TQFP.2 64.8,40.96 51.75,40.96 46.51,35.72 S3.4
D5
  Top 0.305: U1_TQFP.9 71.75,39.01 71.75,37.47 69.22,34.92 69.22,32.38 66.36,29.53 55.56,29.53 51.91,33.18 S3.3
D6
  Top 0.305: U1_TQFP.10 73.66,39.08 73.66,38.73 73.66,38.1 70.17,34.61 70.17,32.07 64.45,26.35 49.53,26.35 48.26,27.62 TP2.TP
D7  (via drill 0.6)
  Top 0.305: U1_TQFP.11 74.61,39.26 74.61,37.78 71.12,34.29 71.12,31.75 64.77,25.4 48.26,25.4 TP1.TP | TX_LINK6.1 28.98,8.89 v26.67,8.89
  Bottom 0.305: TP1.TP 43.81,26.04 41.27,26.04 30.48,15.24 30.48,10.16 29.21,8.89 v26.67,8.89
D8
  Top 0.305: U1_TQFP.12 75.56,39.44 75.56,38.1 75.56,37.47 72.07,33.97 72.07,31.43 65.09,24.45 46.99,24.45 | 46.99,24.45 46.67,24.45 TP6.TP | R33.2 16.36,20.4 U$13.4 16.36,14.91 16.34,14.89 16.34,11.16 16.5,11 17,10.5 31.5,10.5 | 42.5,10.5 48.26,10.5 | 48.26,10.5 53.27,10.5 54,9.77 TX_LINK3.1 | 42.5,10.5 43,10 TX_LINK2.1 | 42.5,10.5 31.5,10.5 | 31.5,10.5 32,10 TX_LINK1.1 | 46.99,24.45 46.99,11.77 48.26,10.5
D9
  Top 0.305: U1_TQFP.13 76.83,39.3 76.83,38.1 76.83,37.47 73.03,33.66 73.03,27.94 74.93,26.04 74.93,7.83 R10.2
D10  (via drill 0.6)
  Top 0.305: U$14.SEL 95.25,15.85 95.25,33.02 94.61,33.66 R24.1 84.03,34.08 83.19,34.92 82.34,34.92 78.42,38.84 | U1_TQFP.14 78.42,38.84 | 78.42,38.84 v78.42,38.73
  Bottom 0.305: JP2.2 70.17,17.02 70.17,26.67 75.56,32.07 75.56,35.24 78.42,38.1 v78.42,38.73
D11/MOSI  (via drill 0.6)
  Top 0.305: U$14.SDI 89.63,13.24 91.44,11.43 94.61,11.43 96.52,13.34 96.52,34.92 95.67,35.77 88.15,35.77 | 88.15,35.77 88.88,36.5 88.88,38.81 87.63,40.05 ISP1.4 | 88.15,35.77 82.62,35.77 82.62,35.8 v81.6,36.83 81.57,36.83 U1_TQFP.15
  Bottom 0.305: JP2.5 73.88,21.81 74.61,22.54 74.61,27.3 78.74,31.43 78.74,34.29 81.28,36.83 v81.6,36.83
D12/MISO  (via drill 0.6)
  Top 0.305: 84.77,37.97 ISP1.1 84.94,37.51 82.19,37.51 v81.28,38.42 81.11,38.42 U1_TQFP.16 | U$14.SDO 93.63,32.1 v93.34,32.38
  Bottom 0.305: v93.34,32.38 90.36,32.38 ISP1.1 | JP2.4 72.49,19.27 71.44,20.32 71.44,26.04 76.83,31.43 76.83,33.97 v81.28,38.42
D13/SCK  (via drill 0.6)
  Top 0.305: U$14.SCK 91.63,12.51 92.08,12.06 94.61,12.06 95.89,13.34 95.89,33.66 94.61,34.92 v90.17,34.92 | ISP1.3 86.85,37.66 85.61,38.9 82.74,38.9 82.7,38.9 v81.6,40.01 81.6,40.04 U1_TQFP.17
  Bottom 0.305: v90.17,34.92 87.63,37.47 ISP1.3 | JP2.3 72.81,16.73 70.8,18.73 70.8,26.35 76.2,31.75 76.2,34.61 v81.6,40.01
D+
  Top 0.254: USB-C.A6 68.33,7.55 68.12,7.76 67.72,7.76 63.99,11.49 63.99,11.69 D7.K 61.53,14.15 IC3.4
D-  (1 unrouted)
  Top 0.254: IC3.5 62.03,14.47 D8.K | 64.77,12.06 68.83,8.01 USB-C.A7
DIG1
  Top 0.305: U$14.ANT 81.63,10.87 C20.1 81.7,9.32 82.13,8.89 85.72,8.89 87,7.62 J$1.SIG
DTR  (via drill 0.6)
  Top 0.305: C23.1 26.04,28.57 26.04,13.62 JP1.1 28.16,11.65 29.21,12.7 v36.2,12.7 | IC3.28 58.26,16.51 v51.44,16.51
  Bottom 0.305: v36.2,12.7 44.45,12.7 48.26,16.51 v51.44,16.51
GND  (via drill 0.6)
  Top 0.254: D8.A 67.09,12.06 C18.2
  Top 0.305: C7.1 C6.1 53.25,13.96 U$6.1 55.77,14.22 59.33,14.22 | USB-C.A1/B12 64.96,6.73 USB-C.GND1 USB-C.GND4 USB-C.GND3 | USB-C.GND3 USB-C.GND2 72.48,6.03 | C10.2 76.62,22.58 C16.2 | 81.03,30.23 U$14.P$12 79.96,30.23 76.62,26.89 C16.2 | C16.2 76.62,25.82 | ISP1.6 91.25,41.27 C1.2 | 17.75,14.23 U$13.5 | U1_TQFP.3 68.15,43.18 69.22,43.18 69.85,42.55 69.78,42.55 U1_TQFP.5 | 59.63,15.29 60.9,15.29 61.03,15.42 IC3.3 61.03,17.64 61.53,18.14 IC3.EXP | 59.63,15.29 59.31,15.61 59.31,16.56 IC3.M | 60.43,13.34 C5.1 59.33,14.22 | C11.2 C4.2 | S3.1 S3.2 | USB-C.B1/A12 71.75,6.76 71.75,7.62 71.12,8.26 70.27,8.26 67.31,11.21 C18.2 C22.2 | 59.63,15.29 59.63,14.52 59.33,14.22 | USB-C.GND3 73.27,1.49 LED1.C 80.86,1.49 J$1.GND@1
  Bottom 0.305: JP1.6 31.59,27.94 TP3.TP | J9.3 83.82,64.14 85.41,62.55 94.3,62.55 97.79,59.05 v97.79,41.27
  other vias: 61.53,18.78 49.21,36.2 46.04,39.37 71.12,42.55 97.79,36.83 97.79,22.23 93.34,39.37 55.56,39.69 61.59,39.69 65.41,13.34 52.39,34.61 55.56,37.15
  pour Top (isolate 0.305): -0.76,43.2 99.26,43.2 99.06,28.57 79.88,28.57 79.88,-0.76 -0.76,-0.76
  pour Bottom (isolate 0.305): -1.4,43.2 99.99,43.2 99.82,32.13 99.69,0 -1.4,-0.77
  pour Top (isolate 0.305): 83.19,15.11 83.19,10.79 88.9,10.79 88.9,-0.64 100.33,-0.64 100.33,15.11
  pour Top (isolate 0.305): 80.01,7.62 85.09,7.62 85.09,2.54 85.09,0 79.38,0 79.38,7.62
  pour Top: 95.25,32.38 95.25,11.43 100.33,11.43 100.33,33.02 95.25,33.02
N$1
  Top 0.305: U1_TQFP.7 66.33,36.83 58.2,36.83 Q1.2 56.29,32.92 C4.1
N$3
  Top 0.305: R22.2 R25.2 | R22.2 R9.2 | R22.2 46.99,70.48 44.45,73.03 41.27,73.03 39.3,75 J4.1
N$4
  Top 0.305: IC3.6 62.53,15.26 63.18,14.61 66.67,14.61 67.31,13.97 C18.1
N$5
  Top 0.305: IC3.26 55.68,18.28 TX_LINK.1
N$6
  Top 0.305: IC3.25 58.36,18.78 RX_LINK1.1
N$7
  Top 0.305: R28.2 76.2,59.05 R1.1 R2.1
  Bottom 0.305: J9.5 81.28,64.14 R1.1
N$8
  Top 0.305: R18.2 R16.2 | R16.2 34.29,70.48 31.75,73.03 28.57,73.03 26.3,75.3 J7.1 | R26.1 R16.2
N$9
  Top 0.305: Q1.1 | U1_TQFP.8 65.95,35.32 Q1.1 | C11.1 65.95,32.5 Q1.1
N$10
  Top 0.305: R5.2 73.03,70.48 70.48,73.03 66.67,73.03 65.3,74.4 J1.1 | R5.2 | R5.2 R19.1 | R7.2 R5.2
N$12
  Top 0.305: R29.2 R37.1 | R36.2 R29.2 | R29.2 20.95,70.48 18.41,73.03 15.24,73.03 13.3,74.97 J8.1
N$13
  Top 0.305: R3.2 60.33,70.48 57.78,73.03 54.61,73.03 52.3,75.33 J2.1 | R3.2 R20.1 | R8.2 R3.2
N$17
  pour Top: 98.55,71.75 94.74,71.75 94.74,68.58 98.81,68.58 98.81,71.75
N$18
  Top 0.305: J12.2 30.5,8 | 30.5,8 30.41,8.09 TX_LINK6.2 | 30.5,8 30.59,8.09 TX_LINK1.2
N$19
  Top 0.305: J13.2 41.5,8 | 41.5,8 41.41,8.09 TX_LINK5.2 | 41.5,8 41.59,8.09 TX_LINK2.2
N$20
  Top 0.305: RBT.1 RBB.2 C17.2 85.72,53.26 IC2.5
N$21
  Top 0.305: TX_LINK3.2 TX_LINK4.2 52.5,8.09 J14.2
N$27
  Top 0.305: R35.2 R34.2 90.59,46.77 91.44,47.62 IC1.7 IC1.8
N$41
  Top 0.305: 75.57,3.58 LED1.A R10.1 | LED1.A 75.57,3.58 | 75.57,3.58 75.85,3.58
RESET  (via drill 0.6)
  Top 0.305: ISP1.5 93.05,37.66 R32.1 | U1_TQFP.29 66.74,48.26 v64.45,48.26 62.23,48.26 39.69,48.26 28.89,37.47 28.09,36.66 C23.2
  Bottom 0.305: v64.45,48.26 67.94,51.75 73.66,51.75 82.87,42.55 91.44,42.55 92.08,41.91 92.08,38.1 91.63,37.66 ISP1.5
(copper drawn outside any net)
  shapes: Top area x1

### Text on the board
Bottom: OpenEnergyMonitor.org
bPlace: 175mm ant | 433Mhz | 87mm ant | V4.0.1 | emonTx | 868Mhz | 78mm ant | 915Mhz | wireless energy monitoring node | Node ID: | Technology that helps us live within ecological limits | Designed in North Wales UK by Glyn Hudson & Trystan Lea | Designed in | Open-Hardware | North Wales | Made in UK | Lead free PCB - RoHS components | OpenEnergyMonitor.org | 4
tNames: RFM69CW | 5V | GND
_tsilk: Designed in | North Wales | Made in UK
_bsilk: SMT V0.6 rev3 | emonTx | wireless energy monitoring node | SMT V0.6 rev3 | emonTx | SMT V0.6 rev3 | emonTx | Technology that helps us live within ecological limits | wireless energy monitoring node | wireless energy monitoring node | Designed in North Wales UK by Glyn Hudson & Trystan Lea | Technology that helps us live within ecological limits | Technology that helps us live within ecological limits | Designed in North Wales UK by Glyn Hudson & Trystan Lea | 165mm ant | 433Mhz | Designed in North Wales UK by Glyn Hudson & Trystan Lea | 165mm ant | 165mm ant | 433Mhz | 433Mhz | 868Mhz | 82mm ant | 82mm ant | 82mm ant | 868Mhz | 868Mhz | 78mm ant | 915Mhz | 78mm ant | 915Mhz | 78mm ant | 915Mhz | 165mm ant | 433Mhz | 82mm ant | 868Mhz | 78mm ant | 915Mhz